# EAGLE design IcosaStellaMedallion (EAGLE 7.5.0)
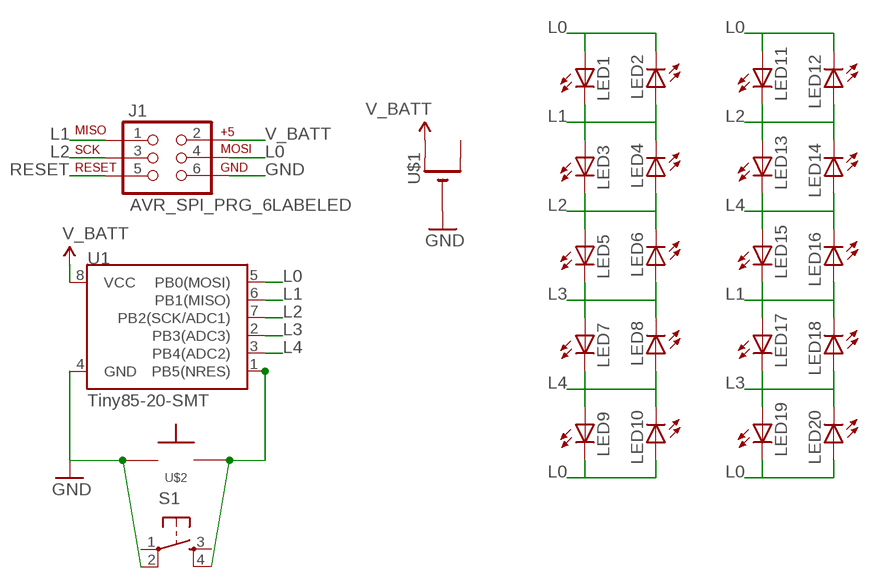
[diagram p0: schematic, sheet 1]

## Parts
J1  AVR_SPI_PRG_6LABELED  [2X3-NS]
LED1  LED5MM  [LED5MM]
LED2  LED5MM  [LED5MM]
LED3  LED5MM  [LED5MM]
LED4  LED5MM  [LED5MM]
LED5  LED5MM  [LED5MM]
LED6  LED5MM  [LED5MM]
LED7  LED5MM  [LED5MM]
LED8  LED5MM  [LED5MM]
LED9  LED5MM  [LED5MM]
LED10  LED5MM  [LED5MM]
LED11  LED5MM  [LED5MM]
LED12  LED5MM  [LED5MM]
LED13  LED5MM  [LED5MM]
LED14  LED5MM  [LED5MM]
LED15  LED5MM  [LED5MM]
LED16  LED5MM  [LED5MM]
LED17  LED5MM  [LED5MM]
LED18  LED5MM  [LED5MM]
LED19  LED5MM  [LED5MM]
LED20  LED5MM  [LED5MM]
S1  TAC_SWITCHSMD  [TACTILE-SWITCH-SMD]
U1  Tiny85-20-SMT  ATTINY45TINY85-20-SMT  [SO08-EIAJ]
U$1  CR2032THM  [CR2032-THRU]
U$2  TAC_SPST_NOSMD  [KXT]

## Nets
GND: J1.6(GND) S1.2 U1.4(GND) U$1.- U$2.1
L0: J1.4(MOSI) LED1.A LED2.K(C) LED9.K(C) LED10.A LED11.A LED12.K(C) LED19.K(C) LED20.A U1.5(PB0(MOSI))
L1: J1.1(MISO) LED1.K(C) LED2.A LED3.A LED4.K(C) LED15.K(C) LED16.A LED17.A LED18.K(C) U1.6(PB1(MISO))
L2: J1.3(SCK) LED3.K(C) LED4.A LED5.A LED6.K(C) LED11.K(C) LED12.A LED13.A LED14.K(C) U1.7(PB2(SCK/ADC1))
L3: LED5.K(C) LED6.A LED7.A LED8.K(C) LED17.K(C) LED18.A LED19.A LED20.K(C) U1.2(PB3(ADC3))
L4: LED7.K(C) LED8.A LED9.A LED10.K(C) LED13.K(C) LED14.A LED15.A LED16.K(C) U1.3(PB4(ADC2))
RESET: J1.5(RST) S1.4 U1.1(PB5(NRES)) U$2.2
V_BATT: J1.2(V+) U1.8(VCC) U$1.+1(+)
Unconnected: S1.1 S1.3 U$1.+2(+1)

## Library data of the parts
J1 = barbary_enterprises:AVR_SPI_PRG_6: AVR ISP 6 Pin This is the reduced ISP connector for AVR programming. Common on Arduino. This footprint will take up less PCB space and can be used with a 10-pin to 6-pin adapter such as SKU: BOB-08508
LED1-LED20 = SparkFun-LED:LED: LEDs Standard schematic elements and footprints for 5mm, 3mm, 1206, and 0603 sized LEDs. 5mm - Spark Fun Electronics SKU : COM-00529 (and others)
S1 = barbary_enterprises:TAC_SWITCH: Momentary Switch Button commonly used for reset or general input. Spark Fun Electronics SKU : COM-00097 SMT- SWCH-08247
U1 = SparkFun-DigitalIC:ATTINY45: Atmel 8-pin 2/4/8kB flash uC; PROD_ID: IC-09092
U$1 = battery:CR2032
U$2 = barbary_enterprises:TAC_SPST_NO: 3,5 mm Tact Switches C&K PTS635 Series * Digi-Key Part Number: CKN9102-ND

## Board
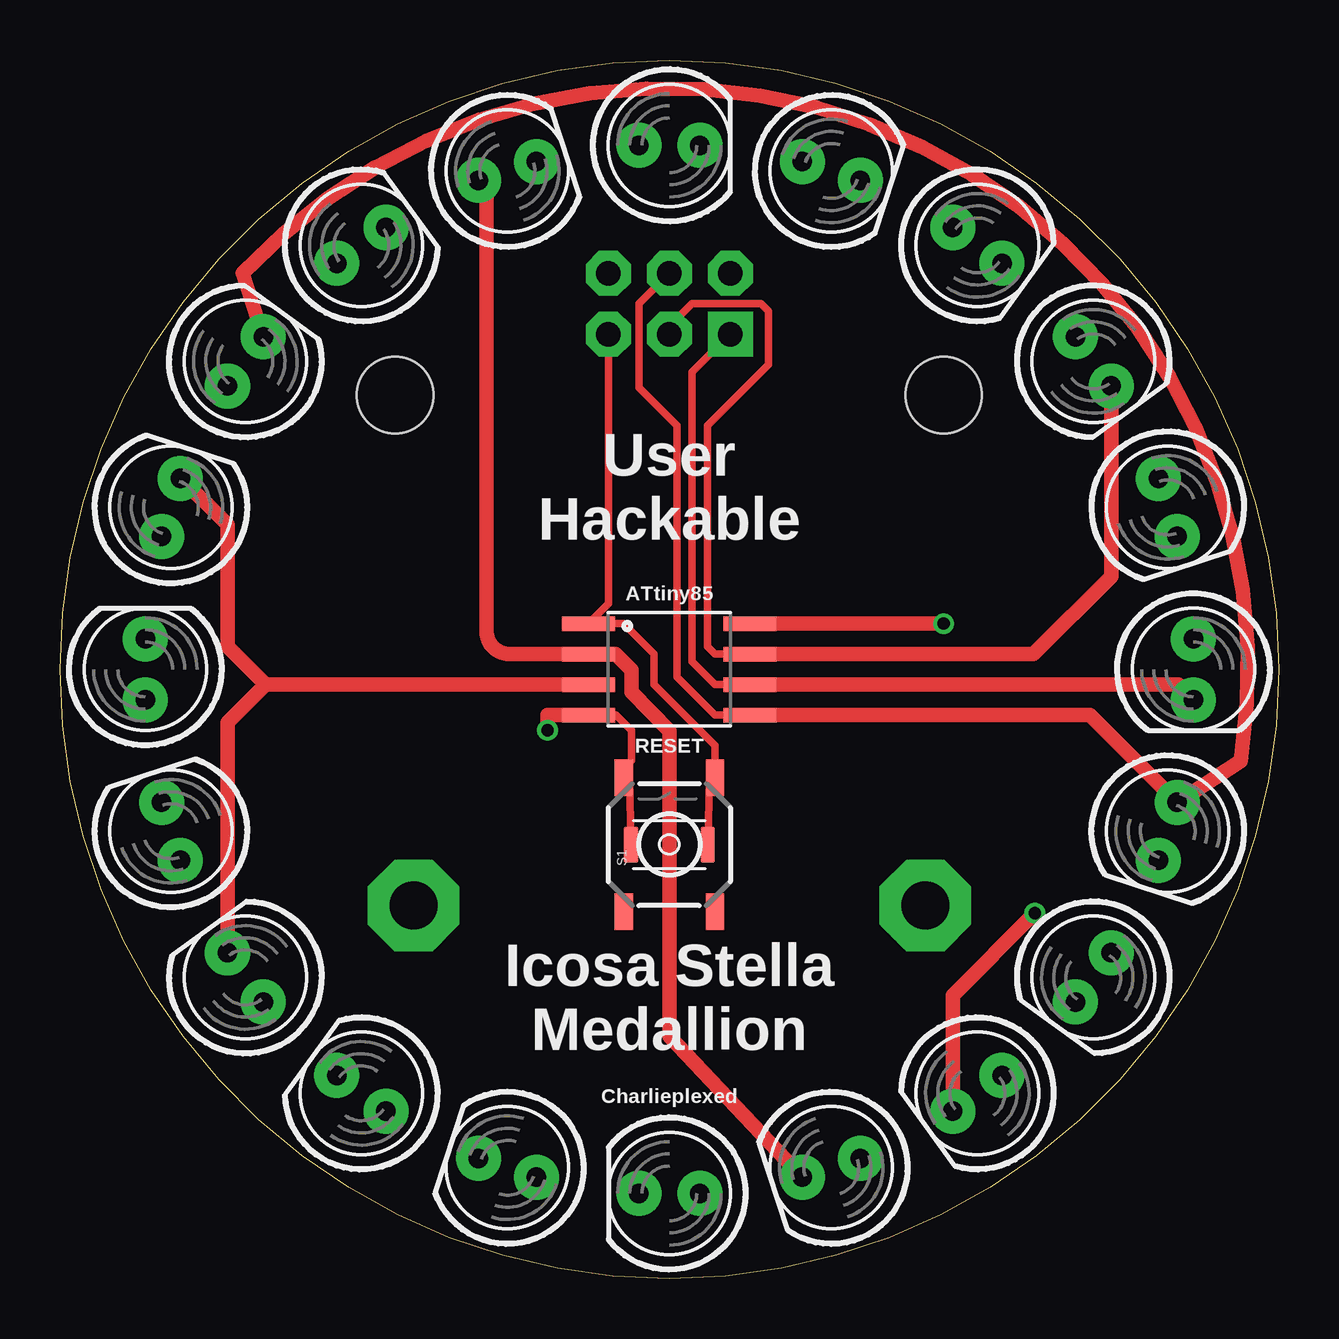
[diagram p1: board, top side]
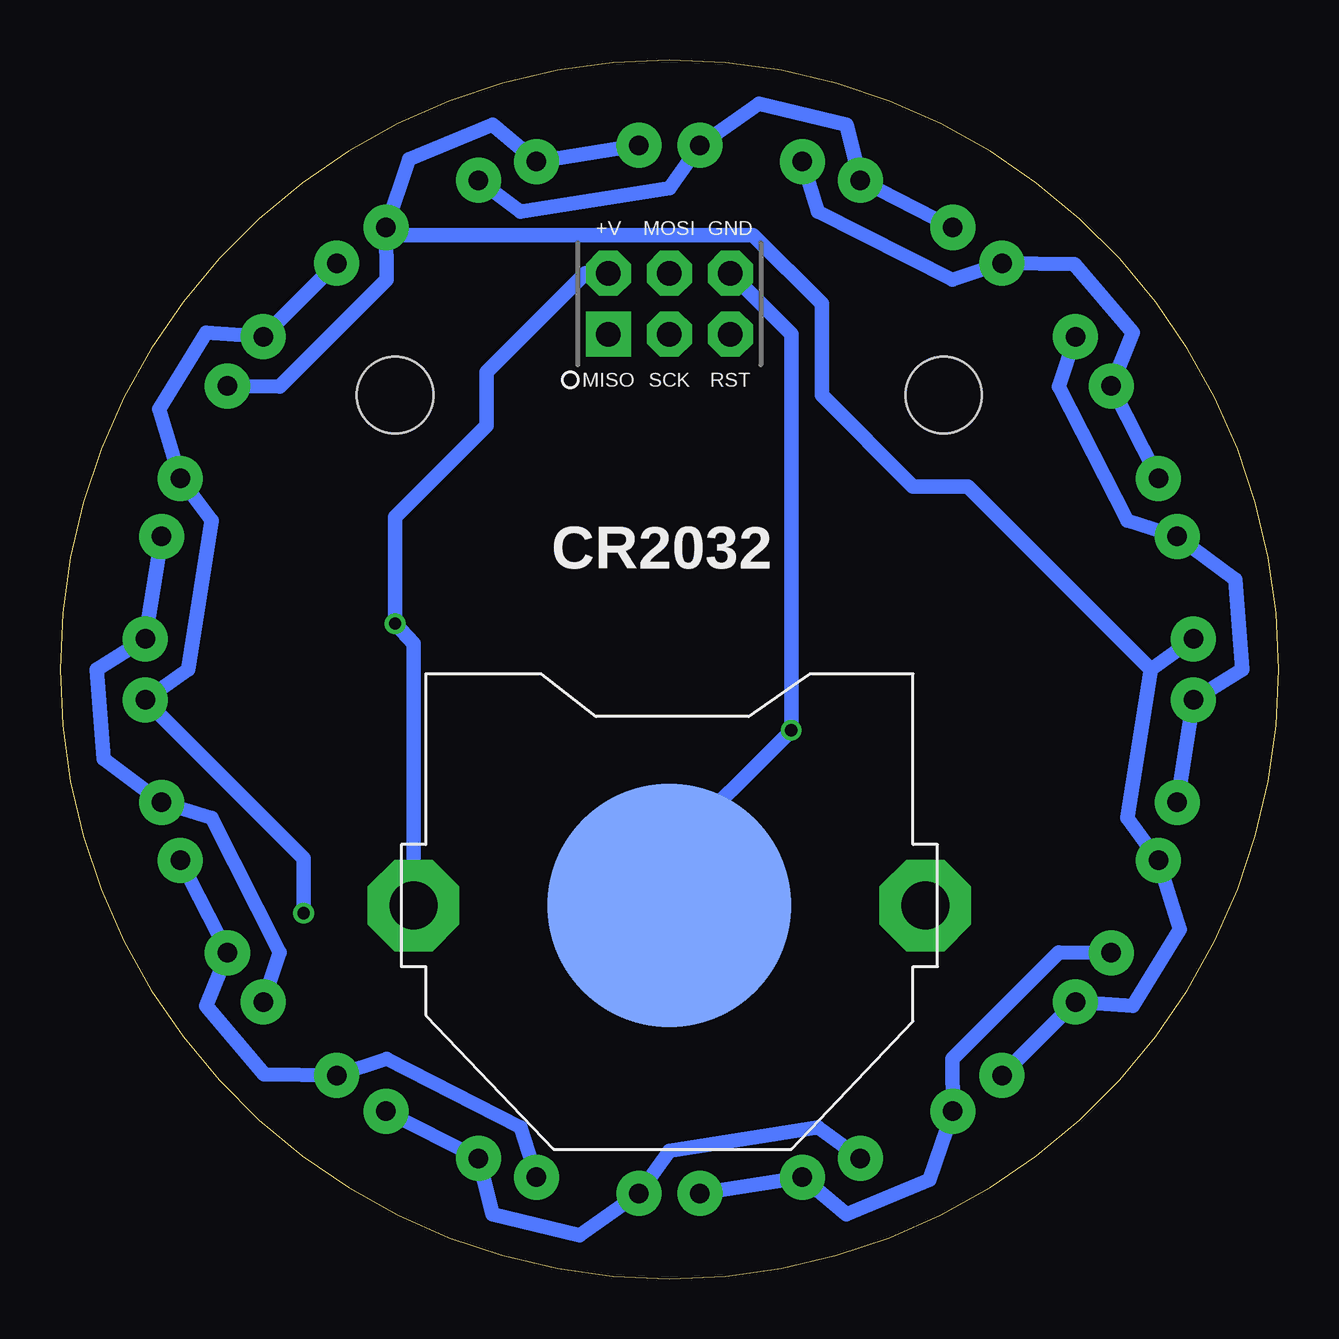
[diagram p2: board, bottom side, seen from below]

Size 50.8 x 50.8 mm. Coordinates in mm from the lower left corner, seen from the top.
Outline: 25.4,50.8 arc-90 50.8,25.4 arc-90 25.4,0 arc-90 0,25.4 arc-90 25.4,50.8
Copper layers (1*16): Top 0.0356mm / dielectric 1.5011mm / Bottom 0.0356mm
Design rules "LaenPCBOrder": minimum track width 6mil, minimum drill 13mil, track to track 6mil, track to pad 6mil, pad to pad 6mil, via to via 6mil, smd to smd 6mil, copper to edge 15mil, drill to drill 6mil, minimum pad ring 7mil, minimum via ring 7mil, stop-mask expansion 3mil, vias tented up to drill 0mil, thermal gap 10mil
Holes 3.17 mm at 13.97,36.83 36.83,36.83

### Footprints (pad centres in the part's own frame; a part is rotated, then mirrored left to right if it is on the bottom)
2X3-NS = drill 1.016 pad 1.88 square: 1 -2.54,-1.27 | drill 1.016 pad 1.88 octagon: 2 -2.54,1.27; 3 0,-1.27; 4 0,1.27; 5 2.54,-1.27; 6 2.54,1.27
LED5MM = drill 0.813 pad 1.88: A -1.27,0; K 1.27,0
TACTILE-SWITCH-SMD = smd 1.524 x 0.762: 1 -2.794,1.905; 2 2.794,1.905; 3 -2.794,-1.905; 4 2.794,-1.905
SO08-EIAJ = smd 0.61 x 2.21: 1 -1.905,-3.378; 2 -0.635,-3.378; 3 0.635,-3.378; 4 1.905,-3.378; 5 1.905,3.353; 6 0.635,3.353; 7 -0.635,3.353; 8 -1.905,3.353
CR2032-THRU = drill 2 pad 3.81 octagon: +1 -10.668,0; +2 10.668,0 | smd 10.16 x 10.16: - 0,0
KXT = smd 0.6 x 1.5: 1 -1.6,0; 2 1.6,0

### Placement (x,y rotation side)
J1  25.4,40.64 0 bottom
LED1  47.24,25.4 270 top
LED2  46.17,32.15 288 top
LED3  43.07,38.24 306 top
LED4  38.24,43.07 324 top
LED5  32.15,46.17 342 top
LED6  25.4,47.24 0 top
LED7  18.65,46.17 18 top
LED8  12.56,43.07 36 top
LED9  7.73,38.24 54 top
LED10  4.63,32.15 72 top
LED11  3.56,25.4 90 top
LED12  4.63,18.65 108 top
LED13  7.73,12.56 126 top
LED14  12.56,7.73 144 top
LED15  18.65,4.63 162 top
LED16  25.4,3.56 180 top
LED17  32.15,4.63 198 top
LED18  38.24,7.73 216 top
LED19  43.07,12.56 234 top
LED20  46.17,18.65 252 top
S1  25.4,18.1 90 top
U1  25.4,25.4 270 top
U$1  25.4,15.56 0 bottom
U$2  25.4,18.1 0 top

### Tracks (layer width: path | path; a pad name or v marks a point on that pad's centre or on a via)
GND  (via drill 0.51)
  Top 0.305: U1.4 23.18,23.5 23.81,22.86 23.81,21.6 23.5,21.29 S1.2 23.74,20.89 U$2.1
  Top 0.61: U1.4 20.32,23.5 v20.32,22.86
  Bottom 0.61: U$1.- 25.4,17.78 v20.32,22.86 20.32,39.37 J1.6
L0
  Top 0.305: U1.5 27.3,23.5 25.72,25.08 25.72,35.56 24.13,37.15 24.13,40.64 J1.4
  Top 0.61: U1.5 42.93,23.5 LED20.A 49.21,21.59 arc146 7.62,41.91 LED9.K
  Bottom 0.61: LED19.K 41.63,13.61 44.48,19.2 LED20.A 48.98,21.66 49.28,25.4 LED1.A LED2.K | LED9.K 9.17,37.19 6.32,31.6 LED10.A 1.82,29.14 1.52,25.4 LED11.A LED12.K
L1  (via drill 0.51)
  Top 0.305: J1.1 26.35,37.78 26.35,25.72 27.3,24.77 U1.6
  Top 0.61: U1.6 46.61,24.77 LED1.K | LED18.K 37.21,11.81 v40.64,15.24
  Bottom 0.61: LED4.K LED3.A 44.72,39.43 46.67,36.24 LED2.A 44.48,31.6 45.47,25.4 LED1.K 40.64,17.53 v40.64,15.24 | LED15.K 19.2,6.32 25.4,5.33 LED16.A 29.14,1.82 32.78,2.69 LED17.A LED18.K
L2
  Top 0.305: J1.3 25.4,39.69 26.35,40.64 29.21,40.64 29.53,40.32 29.53,38.1 26.99,35.56 26.99,26.35 27.3,26.04 U1.7
  Top 0.61: U1.7 40.58,26.04 43.81,29.27 43.81,37.15 LED3.K
  Bottom 0.61: 5.33,25.4 6.32,19.2 LED12.A 4.13,14.56 6.08,11.37 LED13.A LED14.K | LED3.K 41.63,37.19 37.19,41.63 LED4.A | LED4.A 36.24,46.67 32.78,48.11 LED5.A LED6.K | LED11.K 5.33,25.4 | 5.33,25.4 12.95,33.02 15.24,33.02 19.05,36.83 19.05,40.64 21.91,43.5 36.51,43.5 36.83,43.82 LED4.A
L3
  Top 0.61: LED7.A 17.78,45.44 17.78,26.99 arc90 18.73,26.04 U1.2 23.16,26.04 23.81,25.38 23.81,24.45 25.4,22.84 25.4,10.09 LED17.K
  Bottom 0.61: LED20.K LED19.A 44.72,11.37 42.28,8.52 LED18.A 37.19,9.17 31.6,6.32 LED17.K | LED5.K 31.6,44.48 25.4,45.47 LED6.A 21.66,48.98 18.02,48.11 LED7.A LED8.K
L4
  Top 0.61: U1.3 8.57,24.77 | 8.57,24.77 6.99,23.18 6.99,13.65 LED13.K | 8.57,24.77 6.99,26.35 6.99,31.43 5.08,33.34 LED10.K
  Bottom 0.61: LED7.K 19.2,44.48 13.61,41.63 LED8.A 8.52,42.28 6.08,39.43 LED9.A LED10.K | LED13.K 9.17,13.61 13.61,9.17 LED14.A 14.56,4.13 18.02,2.69 LED15.A LED16.K
RESET
  Top 0.305: J1.5 22.86,28.14 U1.1 23.5,27.3 24.77,26.04 24.77,24.77 27.3,22.23 S1.4 27.06,20.89 U$2.2
V_BATT  (via drill 0.51)
  Top 0.61: v36.83,27.3 U1.8
  Bottom 0.61: U$1.+1 36.07,26.48 v36.83,27.3 36.83,31.75 33.02,35.56 33.02,37.78 28.89,41.91 J1.2

### Text on the board
tPlace: User / Hackable | ATtiny85 | RESET | Icosa Stella / Medallion | Charlieplexed
bPlace: CR2032